# EasyEDA schematic SD - Sensor_2021-02-24.json
TITLE: Sensor Unit; REV: 1.0; Date: 2020-11-25; Sheet: 1/1; Drawn By: Dan Even; Company: Your Company
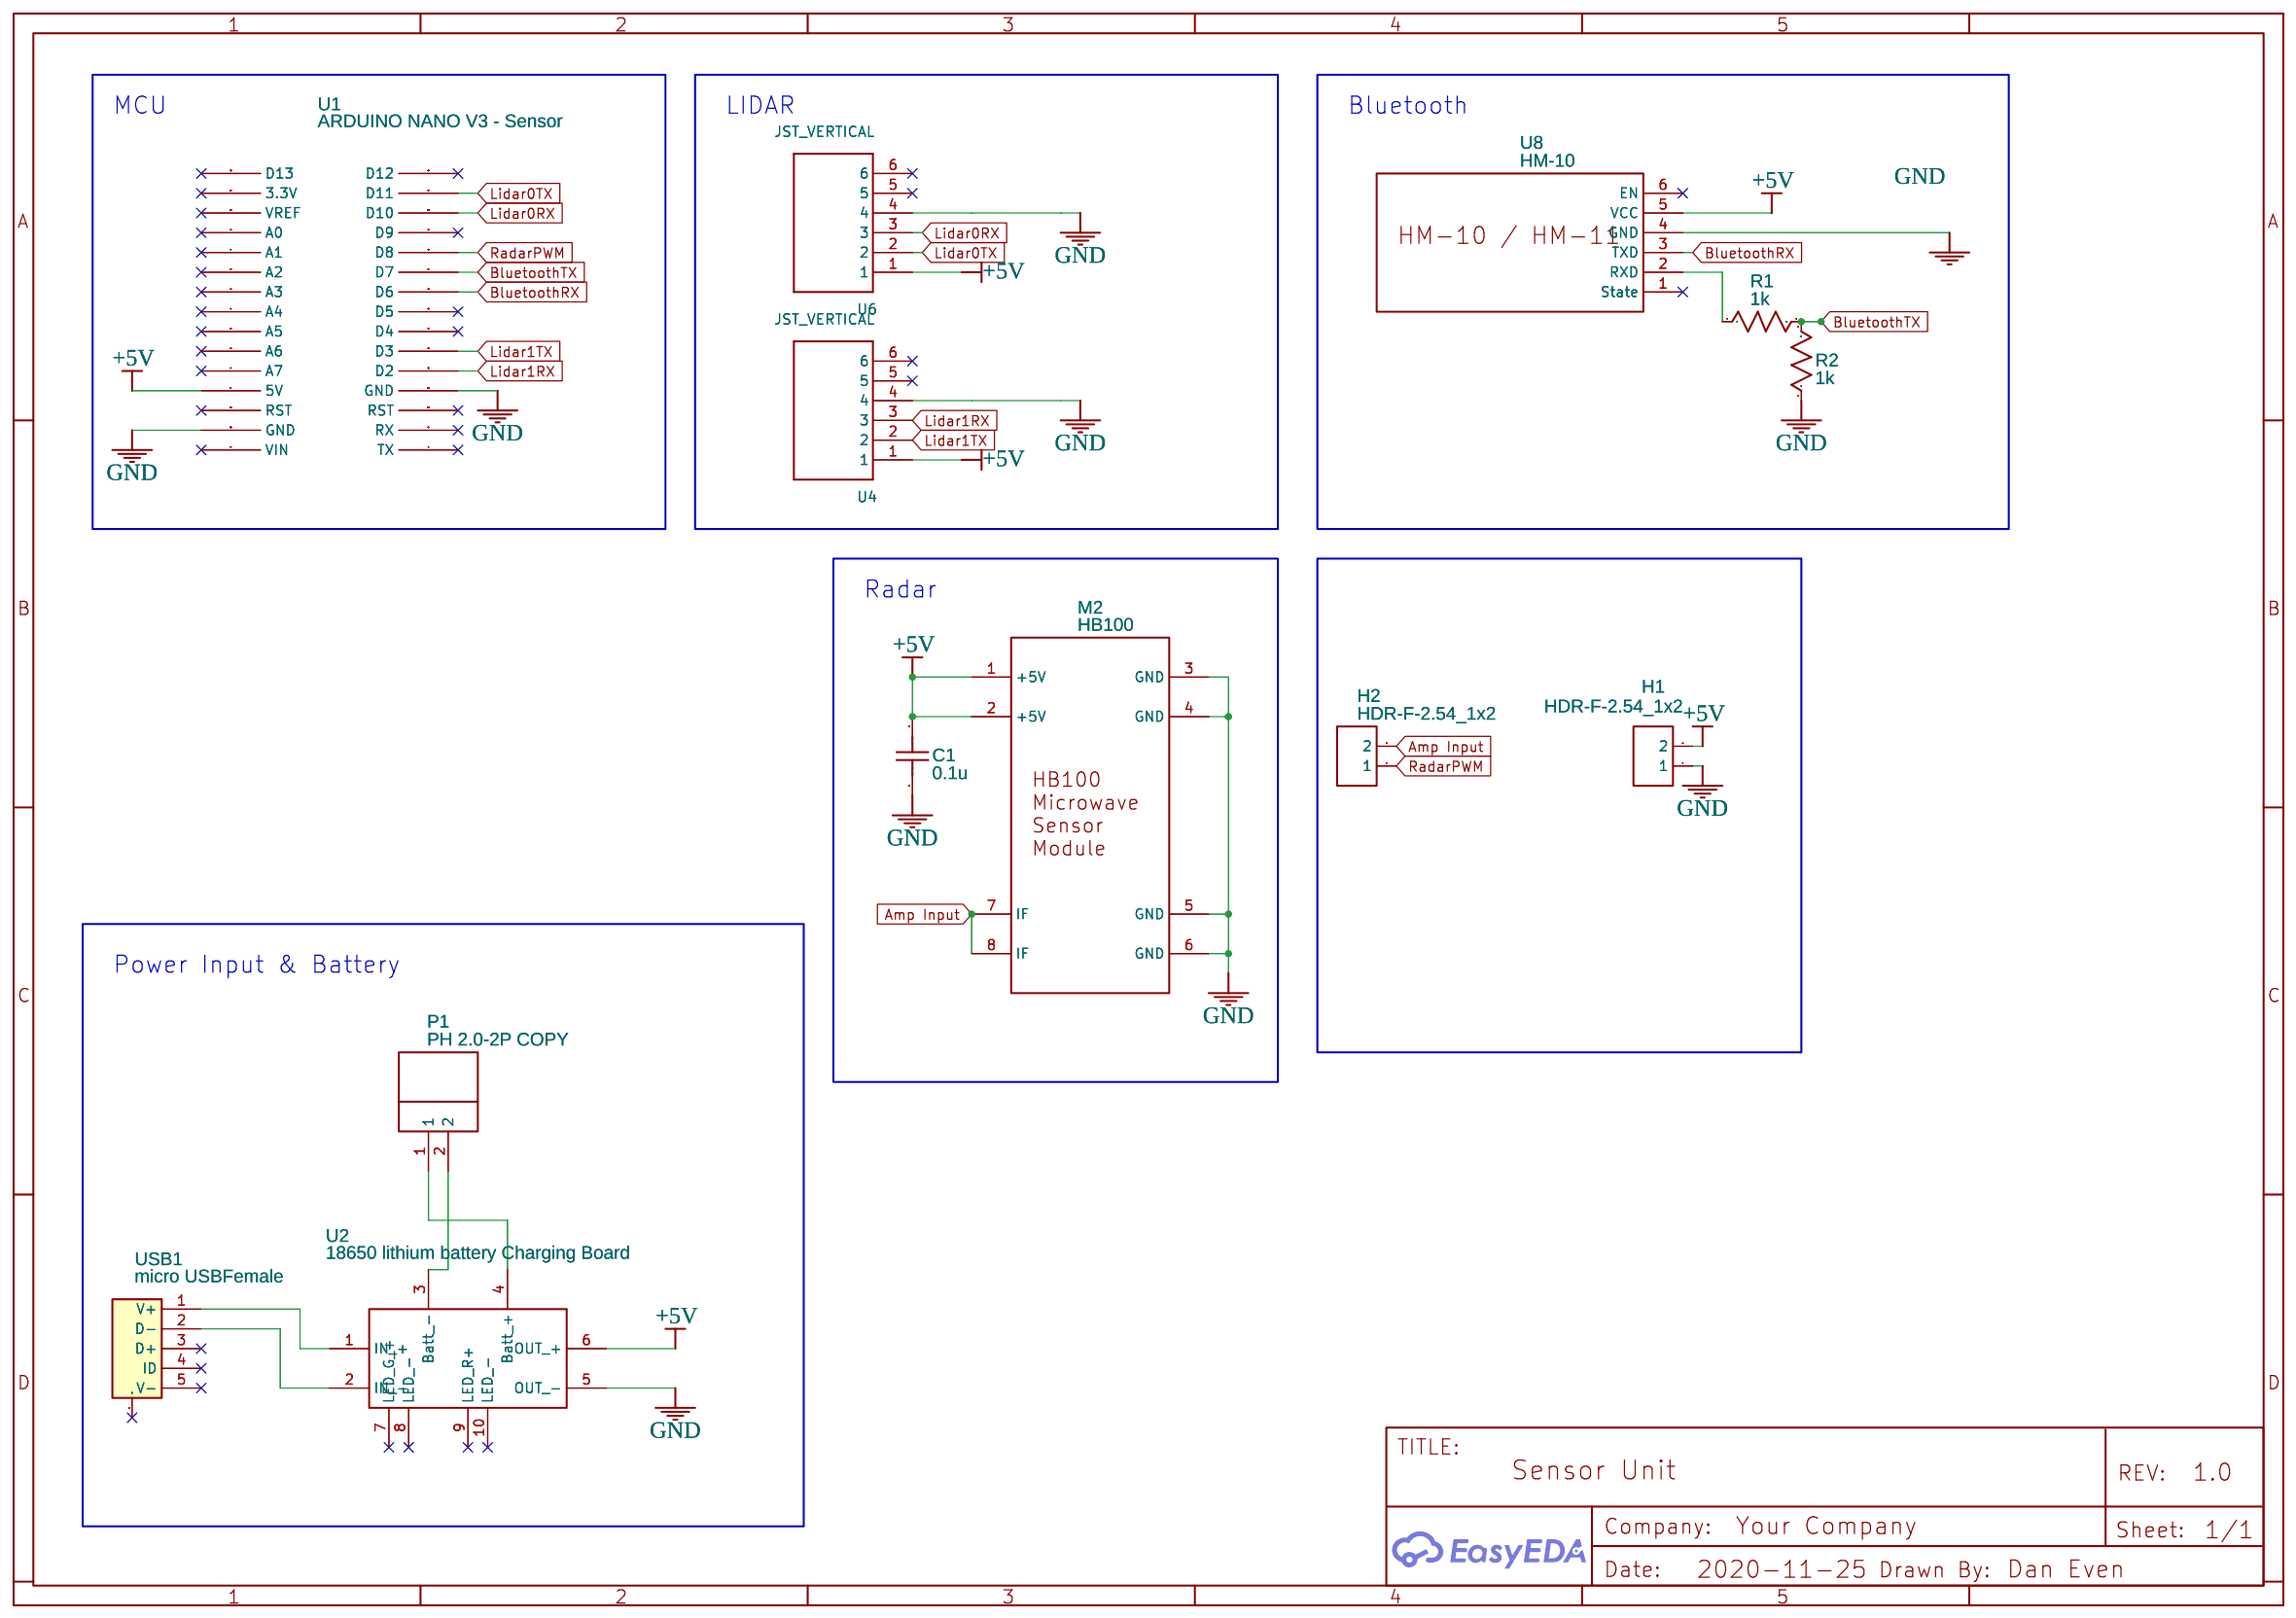
[diagram p0: schematic sheet]

## Parts
C1  0.1u  [RAD-0.1]
H1  HDR-F-2.54_1x2  [HDR-F-2.54_1X2]
H2  HDR-F-2.54_1x2  [HDR-F-2.54_1X2]
M2  HB100  [HB100 MICROWAVE SENSOR MODULE]
P1  PH 2.0-2P COPY  [PH_2.0-2P]
R1  1k  [R_AXIAL-0.4]
R2  1k  [R_AXIAL-0.4]
U1  ARDUINO NANO V3 - Sensor  [ARDUINO NANO]
U2  18650 lithium battery Charging Board  [MH-CD42]
U4  JST_VERTICAL  [JST-6-SMD-VERT-1.0MM]
U6  JST_VERTICAL  [JST-6-SMD-VERT-1.0MM]
U8  HM-10  [HM-10]
USB1  micro USBFemale  [MICRO-USB-SMD_5P-P0.65-H-F_C10418]

## Library data of the parts
C1 = C_RAD-0.1_US: Contributor: LCEDA_Lib
H1 H2 = HDR-F-2.54_1x2: Supplier Part: C49661; Supplier: LCSC; Contributor: LCEDA_Lib
M2 = HB100: Contributor: allen.wallace55
P1 = PH 2.0-2P COPY: Manufacturer Part: PH 2.0-2P; Contributor: 584992092
R1 R2 = R_AXIAL-0.4_US: Contributor: LCEDA_Lib
U1 = ARDUINO NANO V3: Manufacturer Part: arduino_nano1; Contributor: ruby_hofele
U2 = 18650 lithium battery Charging Board: Contributor: AntoineDOSTE
U8 = HM-10: Contributor: erwin.lau
USB1 = micro USBFemale: Supplier: LCSC; Manufacturer: ValuePro; image: //image.lceda.cn/szlcsc/C10418.jpg; Supplier Part: C10418

## Nets
+5V: C1.2 H1.2 M2.1(+5V) M2.2(+5V) U1.5V U2.6(OUT +) U4.1 U6.1 U8.5(VCC)
GND: C1.1 H1.1 M2.3(GND) M2.4(GND) M2.5(GND) M2.6(GND) R2.1 U1.GND1(GND) U1.GND2(GND) U2.5(OUT -) U4.4 U6.4 U8.4(GND)
Amp Input: H2.2 M2.7(IF) M2.8(IF)
BluetoothRX: U1.D6 U8.3(TXD)
BluetoothTX: R1.2 R2.2 U1.D7
Lidar0RX: U1.D10 U6.3
Lidar0TX: U1.D11 U6.2
Lidar1RX: U1.D2 U4.3
Lidar1TX: U1.D3 U4.2
RadarPWM: H2.1 U1.D8
Net-(P1-1): P1.1 U2.4(Batt +)
Net-(P1-2): P1.2 U2.3(Batt -)
Net-(R1-1): R1.1 U8.2(RXD)
Net-(U2-1): U2.1(IN +) USB1.1(V+)
Net-(U2-2): U2.2(IN -) USB1.2(D-)

Not connected (* = marked no-connect by the designer): U1 3.3V* A0* A1* A2* A3* A4* A5* A6* A7* D4* D5* D9* D12* D13* RST1(RST)* RST2(RST)* RX* TX* VIN* VREF*; U2 7(LED G +)* 8(LED -)* 9(LED R+)* 10(LED -)*; U4 5* 6*; U6 5* 6*; U8 1(State)* 6(EN)*; USB1 0(MTN)* 3(D+)* 4(ID)* 5(V-)*

## Notes on the sheet
- MCU
- LIDAR
- Bluetooth
- Radar
- Power Input & Battery
